# EasyEDA Pro project ProProject_开关电源实验平台_2024-07-17.epro, board PCB5
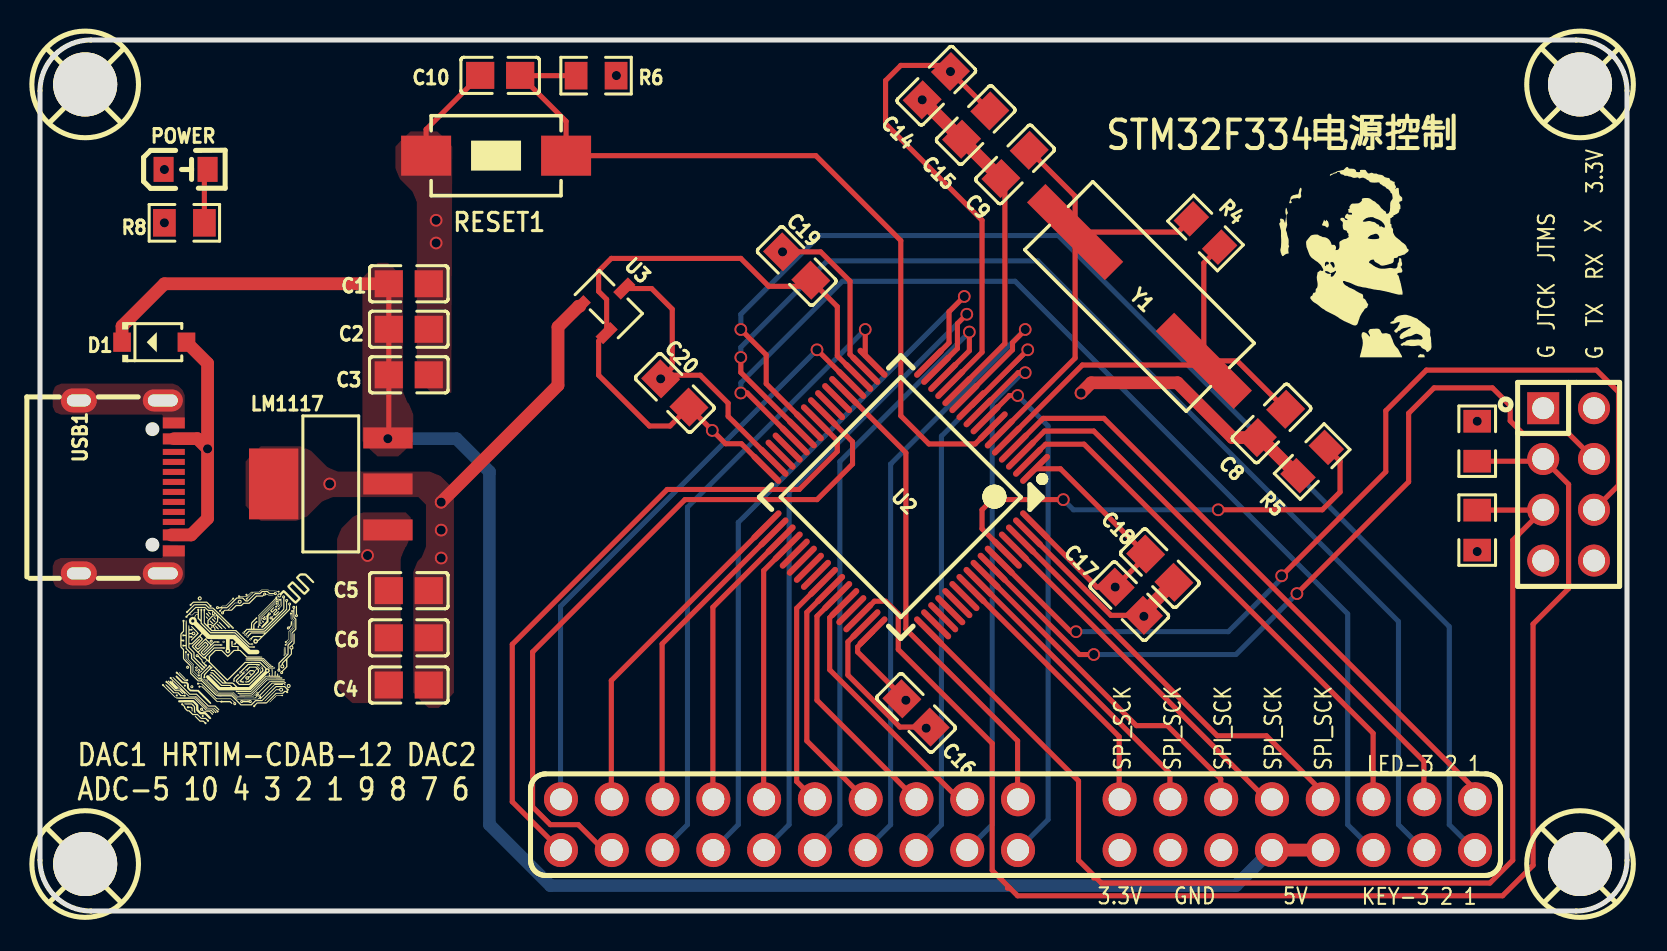
[diagram p10: board, top side]
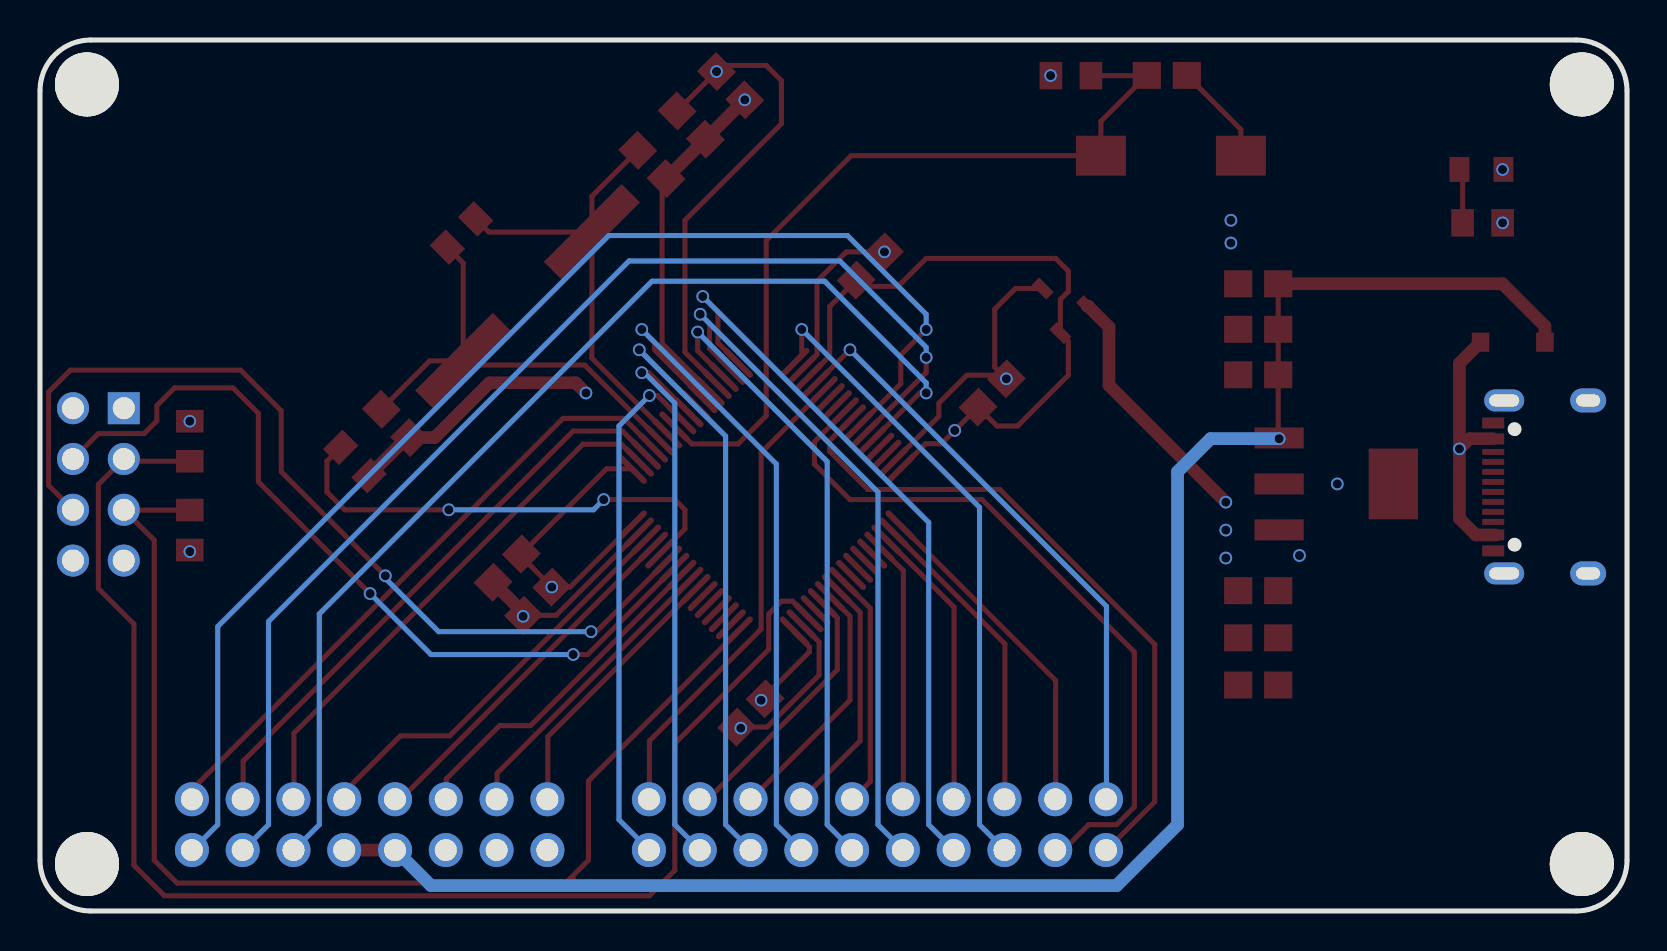
[diagram p11: board, bottom side, seen from below]

Outline 79.38 x 43.56 mm; copper layers: Top Layer, 3V3, GND, Bottom Layer. Coordinates in mm from the lower left corner of the outline.
Outline path: 0,41.02 0,2.54 arc(0.74,0.74) 2.54,0 76.84,0 arc(78.63,0.74) 79.38,2.54 79.38,41.02 arc(78.63,42.82) 76.84,43.56 2.54,43.56 arc(0.74,42.82) 0,41.02
Stack: Top Layer 0.035mm 外层铜厚1oz / Dielectric1 0.2104mm 7628 RC49% 8.6mil / 3V3 0.0152mm 内层铜厚 / Dielectric2 1.065mm 1.1mm H/HOZ 含铜 / GND 0.0152mm 内层铜厚 / Dielectric3 0.2104mm 7628 RC49% 8.6mil / Bottom Layer 0.035mm 外层铜厚1oz

## Design rules (mm)
template: JLCPCB Capability(Two Layers Board)
spacing copperThickness1oz (default): track to track 0.102, other pairs 0.152 to 0.3
spacing copperThickness2oz: track to track 0.203, other pairs 0.152 to 0.3
track width copperThickness1oz (default): min 0.127, default 0.254, max 2.54
track width copperThickness2oz: min 0.203, default 0.254, max 2.54
differential pair differentialPair (default): width min 0.127, default 0.254, max 2.54; gap min 0.152, default 0.152
via viaSize (default): diameter min 0.5, default 0.61, max 10; hole min 0.3, default 0.305, max 6.3

## Placement (name value [footprint] x y rotation side)
C1  100nF  [C0805]  18.45 31.37 180 top
C2  100nF  [C0805]  18.45 29.09 180 top
C3  100nF  [C0805]  18.45 26.82 180 top
C4  100nF  [C0805]  18.45 11.3 0 top
C5  100nF  [C0805]  18.45 16.02 0 top
C6  100nF  [C0805]  18.45 13.66 0 top
C8  22pF  [C0805]  61.59 24.38 225 top
C9  22pF  [C0805]  48.77 37.34 225 top
C10  100nF  [C0805]  23.02 41.79 180 top
C14  100nF  [C0805]  44.83 41.28 45 top
C15  100nF  [C0805]  46.8 39.31 45 top
C16  100nF  [C0805]  43.81 9.91 135 top
C17  100nF  [C0805]  54.48 15.49 135 top
C18  100nF  [C0805]  56.01 17.15 135 top
C19  100nF  [C0805]  37.85 32.26 315 top
C20  100nF  [C0805]  31.75 25.91 315 top
D1  1N4148W  [SOD-123_L2.7-W1.6-LS3.7-FD]  5.72 28.45 180 top
H1  -  [HDR-TH_8P-P2.54-V-F-R2-C4-S2.54-1]  76.45 21.34 270 top
LM1117  LM1117IMPX-3.3/NOPB  [SOT-223_L6.5-W3.5-P2.30-LS7.0-BR]  14.54 21.36 0 top
POWER  -  [LED_0805]  7.33 37.08 0 top
R4  10M  [R0805]  58.29 33.91 135 top
R5  10K  [R0805]  63.63 22.48 225 top
R6  10K  [R0805]  27.81 41.78 0 top
R8  510  [R0805]  7.22 34.42 180 top
R9  5.1K  [R0805]  71.88 23.5 90 top
R10  5.1K  [R0805]  71.88 19.05 90 top
RESET1  -  [sw_pb2_a1]  22.87 37.78 90 top
SCREW1  -  [M3螺丝]  2.32 2.29 0 top
SCREW2  -  [M3螺丝]  2.32 41.28 0 top
SCREW3  -  [M3螺丝]  77.09 41.28 0 top
SCREW4  -  [M3螺丝]  77.09 2.29 0 top
U1  -  [竖插功率接口]  49.04 4.19 0 top
U2  STM32F334R8T6  [LQFP-64_L10.0-W10.0-P0.50-LS12.0-BL]  43.05 20.7 135 top
U3  REF3033AIDBZR  [SOT-23-3_L3.0-W1.7-P0.95-LS2.9-BR]  28.45 30.35 225 top
USB1  TYPE-C 16PIN 2MD(073)  [USB-C-SMD_TYPE-C-6PIN-2MD-073]  4.32 21.21 270 top
Y1  -  [HC-49S_L11.4-W4.8]  54.99 30.73 135 top

## Footprints (pads in the part's own frame, mm; a bottom-side part is the same pattern mirrored in y, then rotated)
C0805
  rect 1.41x1.35 smd: 1(-1,0) 2(1,0)
HC-49S_L11.4-W4.8
  rect 5.5x1.3 smd: 1(-4.553,0) 2(4.553,0)
HDR-TH_8P-P2.54-V-F-R2-C4-S2.54-1
  rect 1.6x1.6 hole 1.1: 1(-3.81,-1.27)
  round 1.6 hole 1.1: 2(-3.81,1.27) 3(-1.27,-1.27) 4(-1.27,1.27) 5(1.27,-1.27) 6(1.27,1.27) 7(3.81,-1.27) 8(3.81,1.27)
LED_0805
  rect 1x1.25 smd: 1(-1.15,0.005) 2(1.05,0.005)
LQFP-64_L10.0-W10.0-P0.50-LS12.0-BL
  oval 0.3x2 smd: 1(-3.75,-5.75) 2(-3.25,-5.75) 3(-2.75,-5.75) 4(-2.25,-5.75) 5(-1.75,-5.75) 6(-1.25,-5.75) 7(-0.75,-5.75) 8(-0.25,-5.75) 9(0.25,-5.75) 10(0.75,-5.75) 11(1.25,-5.75) 12(1.75,-5.75) 13(2.25,-5.75) 14(2.75,-5.75) 15(3.25,-5.75) 16(3.75,-5.75) 33(3.75,5.75) 34(3.25,5.75) 35(2.75,5.75) 36(2.25,5.75) 37(1.75,5.75) 38(1.25,5.75) 39(0.75,5.75) 40(0.25,5.75) 41(-0.25,5.75) 42(-0.75,5.75) 43(-1.25,5.75) 44(-1.75,5.75) 45(-2.25,5.75) 46(-2.75,5.75) 47(-3.25,5.75) 48(-3.75,5.75)
  oval 2x0.3 smd: 17(5.75,-3.75) 18(5.75,-3.25) 19(5.75,-2.75) 20(5.75,-2.25) 21(5.75,-1.75) 22(5.75,-1.25) 23(5.75,-0.75) 24(5.75,-0.25) 25(5.75,0.25) 26(5.75,0.75) 27(5.75,1.25) 28(5.75,1.75) 29(5.75,2.25) 30(5.75,2.75) 31(5.75,3.25) 32(5.75,3.75) 49(-5.75,3.75) 50(-5.75,3.25) 51(-5.75,2.75) 52(-5.75,2.25) 53(-5.75,1.75) 54(-5.75,1.25) 55(-5.75,0.75) 56(-5.75,0.25) 57(-5.75,-0.25) 58(-5.75,-0.75) 59(-5.75,-1.25) 60(-5.75,-1.75) 61(-5.75,-2.25) 62(-5.75,-2.75) 63(-5.75,-3.25) 64(-5.75,-3.75)
M3螺丝
  round 3.2 hole 3.2: 1(-0.064,0.064)
R0805
  rect 1.133x1.377 smd: 1(-1,0) 2(1,0)
SOD-123_L2.7-W1.6-LS3.7-FD
  rect 0.88x0.96 smd: 1(-1.61,0) 2(1.61,0)
SOT-23-3_L3.0-W1.7-P0.95-LS2.9-BR
  rect 1.038x0.532 smd: 1(1.102,-0.95) 2(1.102,0.95) 3(-1.101,0)
SOT-223_L6.5-W3.5-P2.30-LS7.0-BR
  rect 2.465x1.05 smd: 1(2.857,-2.3) 2(2.857,0) 3(2.857,2.3)
  rect 2.465x3.54 smd: 4(-2.857,0)
sw_pb2_a1
  rect 2x2.5 smd: 1(0,3.556) 2(0,-3.444)
USB-C-SMD_TYPE-C-6PIN-2MD-073
  rect 0.55x1.1 smd: 1(-3.2,2.375) 2(-2.4,2.375) 11(2.4,2.375) 12(3.2,2.375)
  rect 0.3x1.1 smd: 3(-1.75,2.375) 4(-1.25,2.375) 5(-0.75,2.375) 6(-0.25,2.375) 7(0.25,2.375) 8(0.75,2.375) 9(1.25,2.375) 10(1.75,2.375)
  oval 1.1x2 hole 0.6x1.5: 13(-4.325,1.825) 14(4.325,1.825)
  oval 1.2x1.8 hole 0.6x1.2: 13(-4.325,-2.375) 14(4.325,-2.375)
竖插功率接口
  round 1.7 hole 1.1: 1(-22.987,-1.143) 2(-20.447,-1.143) 3(-17.907,-1.143) 4(-15.367,-1.143) 5(-12.827,-1.143) 6(-10.287,-1.143) 7(-7.747,-1.143) 8(-5.207,-1.143) 9(-2.667,-1.143) 10(-0.127,-1.143) 11(-22.987,1.397) 12(-20.447,1.397) 13(-17.907,1.397) 14(-15.367,1.397) 15(-12.827,1.397) 16(-10.287,1.397) 17(-7.747,1.397) 18(-5.207,1.397) 19(-2.667,1.397) 20(-0.127,1.397) 21(4.953,-1.143) 22(7.493,-1.143) 23(10.033,-1.143) 24(12.573,-1.143) 25(15.113,-1.143) 26(4.953,1.397) 27(7.493,1.397) 28(10.033,1.397) 29(12.573,1.397) 30(15.113,1.397) 41(17.653,-1.143) 42(20.193,-1.143) 43(22.733,-1.143) 44(17.653,1.397) 45(20.193,1.397) 46(22.733,1.397)

## Nets
+3.3V: C4.2 C5.2 C6.2 C14.2 C15.2 H1.1 LM1117.2 LM1117.4 R6.2 R8.2 R9.2 R10.1 U1.21 U2.13 U3.1
+5V: C1.2 C2.2 C3.2 D1.2 LM1117.3 U1.24 U1.25
GND: C1.1 C2.1 C3.1 C4.1 C5.1 C6.1 C8.2 C9.2 C10.2 C14.1 C15.1 C16.1 C17.1 C18.1 C19.1 C20.1 H1.7 H1.8 LM1117.1 POWER.1 R5.2 RESET1.1 U1.22 U1.23 U2.12 U2.18 U2.31 U2.47 U2.63 U3.3 USB1.1 USB1.12 USB1.13 USB1.14
ADC1: U1.6 U2.14
ADC2: U1.5 U2.15
ADC3: U1.4 U2.16
ADC4: U1.3 U2.17
ADC5: U1.1 U2.25
ADC6: U1.10 U2.8
ADC7: U1.9 U2.9
ADC8: U1.8 U2.10
ADC9: U1.7 U2.11
ADC10: U1.2 U2.24
DAC1: U1.11 U2.20
DAC2: U1.20 U2.21
HRTIM_CHA1: U1.16 U2.41
HRTIM_CHA2: U1.17 U2.42
HRTIM_CHB1: U1.18 U2.43
HRTIM_CHB2: U1.19 U2.44
HRTIM_CHC1: U1.12 U2.33
HRTIM_CHC2: U1.13 U2.34
HRTIM_CHD1: U1.14 U2.35
HRTIM_CHD2: U1.15 U2.36
I2C1_SCL: U1.29 U2.61
I2C1_SDA: U1.30 U2.62
JTCK: H1.5 R10.2 U2.49
JTMS: H1.3 R9.1 U2.46
KEY1: U1.43 U2.26
KEY2: U1.42 U2.27
KEY3: U1.41 U2.28
LED1: U1.46 U2.4
LED2: U1.45 U2.3
LED3: U1.44 U2.2
REF_3V3: C16.2 C17.2 C18.2 C19.2 C20.2 U2.1 U2.19 U2.32 U2.48 U2.64 U3.2
SPI_MISO: U1.28 U2.57
SPI_MOSI: U1.27 U2.56
SPI_SCK: U1.26 U2.55
UART1_RX: H1.6 U2.59
UART1_TX: H1.4 U2.58
$1N1023: C9.1 R4.2 U2.6 Y1.2
$1N1024: C8.1 R4.1 U2.5 Y1.1
$1N1027: C10.1 R6.1 RESET1.2 U2.7
$1N1130: R5.1 U2.60
$1N1219: POWER.2 R8.1
$1N7345: D1.1 USB1.2 USB1.11

Pads without a net: H1 2; SCREW1 1; SCREW2 1; SCREW3 1; SCREW4 1; U2 22 23 29 30 37 38 39 40 45 50 51 52 53 54; USB1 3 4 5 6 7 8 9 10

## Via types
v1: diameter 0.635, hole 0.457, Top Layer to Bottom Layer, 42 vias

## Routing (per net, layer and track width the routed paths; a pad name or vN(x,y) marks a point on that pad's centre or on a via; arc(x,y) is an arc through that point)
+3.3V: length 37
  Top Layer w0.254: U2.13 47.12,27.95 47.12,34.54 42.29,39.37 42.29,41.53 43.05,42.29 45.23,42.29 v1(45.54,41.98) C15.2
  Top Layer w0.635: U3.1 26.94,30.25 25.91,29.21 25.91,26.29 v1(20.07,20.45)
  vias: v1(6.22,34.42) v1(14.49,21.36) v1(20.07,19.05) v1(20.07,17.65) v1(28.83,41.78) v1(71.88,24.5) v1(71.88,17.98)
+5V: length 89.8
  Top Layer w0.254: C1.2 C2.2 C3.2 17.45,23.7 LM1117.3
  Top Layer w0.635: 64.14,3.05 61.59,3.05 ; C1.2 6.22,31.37 4.11,29.25 D1.2
  Bottom Layer w0.635: v1(17.4,23.62) 20.83,23.62 22.48,21.97 22.48,4.32 25.53,1.27 59.82,1.27 61.59,3.05
GND: length 76.2
  Top Layer w0.254: 49.42,18.93 53.56,14.79 C17.1 ; 31.22,26.8 31.62,27.2 31.62,30.1 30.59,31.13 29.23,31.13 ; 31.22,26.8 33.02,26.8 34.42,25.4 34.42,24.74 U2.31 ; 31.22,26.8 v1(31.04,26.62) ; RESET1.1 19.31,39.09 C10.2 ; U2.18 40.51,27.84 40.51,31.5 39.04,32.97 v1(37.14,32.97) ; U2.47 40.41,13.46 40.41,11.8 43.01,9.2 C16.1 ; U2.12 48.26,28.38 48.26,36.43 48.06,36.63
  Top Layer w0.635: C18.1 55.19,14.91 C17.1 ; v1(44.12,40.57) C15.1 48.06,36.63 ; v1(52.07,25.91) 52.58,26.42 56.9,26.42 59.64,23.68 C8.2 61.02,23.68 62.92,21.77
  vias: v1(6.22,37.08) v1(16.38,17.78) v1(19.81,34.54) v1(19.81,33.41) v1(44.32,9.14) v1(55.21,14.74)
ADC1: length 31.9
  Top Layer w0.254: U2.14 46.48,28.02 v1(46.48,28.96)
  Bottom Layer w0.254: v1(46.48,28.96) 40,22.48 40,4.32 38.74,3.05
ADC2: length 34.4
  Top Layer w0.254: U2.15 45.89,28.13 45.89,29.38 v1(46.36,29.84)
  Bottom Layer w0.254: v1(46.36,29.84) 37.47,20.95 37.47,4.32 36.19,3.05
ADC3: length 36.9
  Top Layer w0.254: 44.47,27.42 45.47,28.42 45.47,29.97 v1(46.23,30.73)
  Bottom Layer w0.254: v1(46.23,30.73) 34.93,19.43 34.93,4.32 33.66,3.05
ADC4: length 32.1
  Top Layer w0.254: v1(41.28,29.08) 41.28,27.78 U2.17
  Bottom Layer w0.254: v1(41.28,29.08) 32.39,20.19 32.39,4.32 31.12,3.05
ADC5: length 33.6
  Top Layer w0.254: 26.03,3.05 23.62,5.46 23.62,13.34 31.37,21.08 37.97,21.08 39.88,22.99 39.88,23.52 38.81,24.59
ADC6: length 26.1
  Top Layer w0.254: 47.3,24.59 48.49,25.78 v1(48.9,25.78)
  Bottom Layer w0.254: v1(48.9,25.78) 50.42,24.26 50.42,4.57 48.9,3.05
ADC7: length 28.3
  Top Layer w0.254: v1(49.28,26.92) 48.92,26.92 U2.9
  Bottom Layer w0.254: v1(49.28,26.92) 49.15,26.92 47.62,25.4 47.62,4.32 46.36,3.05
ADC8: length 31.3
  Top Layer w0.254: U2.10 46.63,25.3 v1(49.4,28.07)
  Bottom Layer w0.254: 43.81,3.05 45.09,4.32 45.09,23.75 v1(49.4,28.07)
ADC9: length 34
  Top Layer w0.254: U2.11 46.24,25.66 48.64,28.07 48.64,28.43 49.28,29.06 v1(49.28,29.08)
  Bottom Layer w0.254: 41.28,3.05 42.55,4.32 42.55,22.35 v1(49.28,29.08)
ADC10: length 35.7
  Top Layer w0.254: 28.58,3.05 28.19,3.05 26.92,4.32 25.53,4.32 24.64,5.21 24.64,12.95 32.26,20.57 38.86,20.57 40.64,22.35 40.64,23.47 U2.24
DAC1: length 30.2
  Top Layer w0.254: v1(38.86,28.07) 38.87,28.07 U2.20
  Bottom Layer w0.254: 26.03,5.59 26.03,15.24 v1(38.86,28.07)
DAC2: length 24
  Top Layer w0.254: 40.22,26 43.31,22.92 43.31,14.1 48.9,8.51 48.9,5.59
HRTIM_CHA1: length 11.8
  Top Layer w0.254: 38.74,5.59 37.85,6.48 37.85,15.14 U2.41
HRTIM_CHA2: length 12.2
  Top Layer w0.254: 41.28,5.59 38.35,8.51 38.35,14.94 U2.42
HRTIM_CHB1: length 12.6
  Top Layer w0.254: 43.81,5.59 38.86,10.54 38.86,14.74 39.87,15.75
HRTIM_CHB2: length 13.2
  Top Layer w0.254: 40.22,15.4 39.5,14.67 39.5,12.07 45.97,5.59 46.36,5.59
HRTIM_CHC1: length 16.9
  Top Layer w0.254: U2.33 28.58,11.53 28.58,5.59
HRTIM_CHC2: length 15.7
  Top Layer w0.254: 31.12,5.59 31.12,13.36 U2.34
HRTIM_CHD1: length 14.4
  Top Layer w0.254: 33.66,5.59 33.66,15.19 37.04,18.58
HRTIM_CHD2: length 13.1
  Top Layer w0.254: 36.19,5.59 36.19,17.03 37.4,18.23
I2C1_SCL: length 18.1
  Top Layer w0.254: 48.71,18.23 48.71,18.22 61.34,5.59 61.59,5.59
I2C1_SDA: length 20.7
  Top Layer w0.254: 49.06,18.58 58.88,8.76 61.34,8.76 64.14,5.97 64.14,5.59
JTCK: length 58.8
  Top Layer w0.254: 52.83,1.65 53.09,1.4 72.52,1.4 73.66,2.54 73.66,18.54 75.17,20.05 ; 52.83,1.65 51.94,2.54 51.94,6.51 44.47,13.98 ; 52.83,1.65 52.71,1.65 ; 75.17,20.05 R10.2 ; 75.17,20.05 H1.5
JTMS: length 70.6
  Top Layer w0.254: R9.1 75.07,22.5 H1.3 76.45,21.34 76.45,16.13 74.68,14.35 74.68,2.29 73.15,0.76 48.9,0.76 48.51,1.14 ; 48.39,1.14 48.51,1.14 ; 48.51,1.14 47.62,2.03 47.62,8.38 42.93,13.08 42.93,14.86 42.29,15.49 41.74,15.49 U2.46
KEY1: length 63.9
  Top Layer w0.254: 38.46,24.24 36.32,26.37 36.32,27.81 v1(35.05,29.08)
  Bottom Layer w0.254: v1(35.05,29.08) 35.05,29.84 38.99,33.78 50.93,33.78 70.49,14.22 70.49,4.32 71.75,3.05
KEY2: length 59.7
  Top Layer w0.254: U2.27 35.05,26.93 v1(35.05,27.69)
  Bottom Layer w0.254: 69.22,3.05 67.94,4.32 67.94,14.48 49.91,32.51 39.37,32.51 35.05,28.19 v1(35.05,27.69)
KEY3: length 55.9
  Top Layer w0.254: v1(35.05,25.91) 35.37,25.91 U2.28
  Bottom Layer w0.254: 66.68,3.05 65.41,4.32 65.41,14.86 48.77,31.5 40.13,31.5 35.05,26.42 v1(35.05,25.91)
LED1: length 31.8
  Top Layer w0.254: 71.75,5.59 71.75,6.1 53.21,24.64 50.17,24.64 48.71,23.18
LED2: length 29.4
  Top Layer w0.254: 69.22,5.59 69.22,7.49 52.71,24 50.24,24 49.06,22.82
LED3: length 26.9
  Top Layer w0.254: 66.68,5.59 66.68,8.89 52.22,23.35 50.3,23.35 49.42,22.47
REF_3V3: length 94.7
  Top Layer w0.254: U2.64 52.86,16.2 v1(53.78,16.2) 55.3,17.73 C18.2 51.04,22.12 U2.1 ; 43.24,10.61 C16.2 ; 43.24,10.61 40.89,12.95 40.89,13.21 41.64,13.95 U2.48 ; 43.24,10.61 v1(43.31,10.54) ; U2.19 39.88,27.77 39.88,30.23 C19.2 38.24,31.24 36.45,31.24 35.05,32.64 28.58,32.64 27.94,32 27.94,30.99 28.34,30.59 28.34,28.9 27.94,28.5 27.94,26.8 30.48,24.26 31.51,24.26 C20.2 v1(33.62,24.03) 34.29,23.37 35.08,23.37 U2.32
  GND w0.254: v1(43.31,10.54) 43.31,14.35 v1(33.62,24.03) 45.94,24.03 v1(53.78,16.2)
SPI_MISO: length 17
  Top Layer w0.254: 47.3,16.81 54.84,9.27 56.39,9.27 59.06,6.6 59.06,5.59
SPI_MOSI: length 14.8
  Top Layer w0.254: U2.56 56.52,6.89 56.52,5.59
SPI_SCK: length 13.6
  Top Layer w0.254: U2.55 53.97,8.72 53.97,5.59
UART1_RX: length 46.2
  Top Layer w0.254: U2.59 51.55,13.97 ; v1(62.1,16.76) 67.31,21.97 67.31,25.02 69.34,27.05 77.85,27.05 78.95,25.95 78.95,21.29 H1.6
  Bottom Layer w0.254: v1(51.82,13.97) 59.44,13.97 62.1,16.64
UART1_TX: length 41.3
  Top Layer w0.254: v1(52.71,12.83) 51.99,12.83 U2.58 ; v1(62.87,15.88) 68.45,21.46 68.45,24.89 69.72,26.16 72.64,26.16 73.53,25.27 73.53,24.51 74.17,23.88 76.45,23.88 H1.4
  Bottom Layer w0.254: v1(52.71,12.83) 59.82,12.83 v1(62.87,15.88)
$1N1023: length 22.8
  Top Layer w0.254: U2.6 51.77,27.65 Y1.2 ; R4.2 56.92,33.95 Y1.2 ; Y1.2 51.77,35.75 49.47,38.05
$1N1024: length 22.6
  Top Layer w0.254: C8.1 59.88,27.51 Y1.1 ; R4.1 58.21,32.41 Y1.1 ; Y1.1 58,27.31 52.13,27.31 U2.5
$1N1027: length 40.6
  Top Layer w0.254: U2.7 46.77,23.36 44.46,23.36 43.05,24.77 43.05,33.53 38.81,37.78 RESET1.2 26.31,39.49 24.03,41.78 ; 24.03,41.78 C10.1 ; 24.03,41.78 R6.1
$1N1130: length 23.9
  Top Layer w0.254: U2.60 47.12,19.11 47.12,20.07 47.62,20.57 v1(51.18,20.57) ; 64.33,23.19 65.02,22.5 65.02,20.95 64.14,20.07 v1(58.93,20.07)
  Bottom Layer w0.254: v1(51.18,20.57) 51.69,20.07 v1(58.93,20.07)
$1N1219: length 2.7
  Top Layer w0.254: POWER.2 8.22,36.93 R8.1
$1N7345: length 13.3
  Top Layer w0.635: v1(8.38,23.11) 8.38,27.39 D1.1 ; v1(8.38,23.11) 8.38,19.63 7.56,18.81 6.57,18.81 ; v1(8.38,23.11) 7.87,23.62 6.71,23.62

## Copper pours and planes (outline as drawn; the poured copper is in the pictures)
+3.3V on Top Layer: 10.28,23.24 20.7,23.24 20.7,10.16 10.28,10.16
+3.3V on 3V3: -1.9,46.86 83.44,46.86 83.44,-1.02 -1.9,-1.02
+5V on Top Layer: 16.13,32.41 18.67,32.41 18.67,22.73 16.13,22.73
GND on Top Layer: -4.57,48.64 85.22,48.64 85.22,-5.59 -4.57,-5.59
GND on Top Layer: 14.86,19.94 18.54,19.94 18.54,10.4 14.86,10.4
GND on Top Layer: 17.78,38.99 20.62,38.99 20.62,25.91 17.78,25.91
GND on Top Layer: 0.64,26.38 7.24,26.38 7.24,24.17 0.64,24.17
GND on Top Layer: 0.64,18.31 7.24,18.31 7.24,16.1 0.64,16.1
GND on Bottom Layer: -3.17,47.62 84.84,47.62 84.84,-3.05 -3.17,-3.05
GND on GND: -3.17,48.64 84.58,48.64 84.58,-5.97 -3.17,-5.97

## Text on the board
Top Silkscreen Layer: SPI_SCK | 3.3V | GND | 5V | KEY-3 2 1 | LED-3 2 1 | JTMS | JTCK | G | X | RX | TX | DAC1 HRTIM-CDAB-12 DAC2 / ADC-5 10 4 3 2 1 9 8 7 6 | STM32F334电源控制
